# Altium project STM32F103RCT6最小系统.PrjPCB
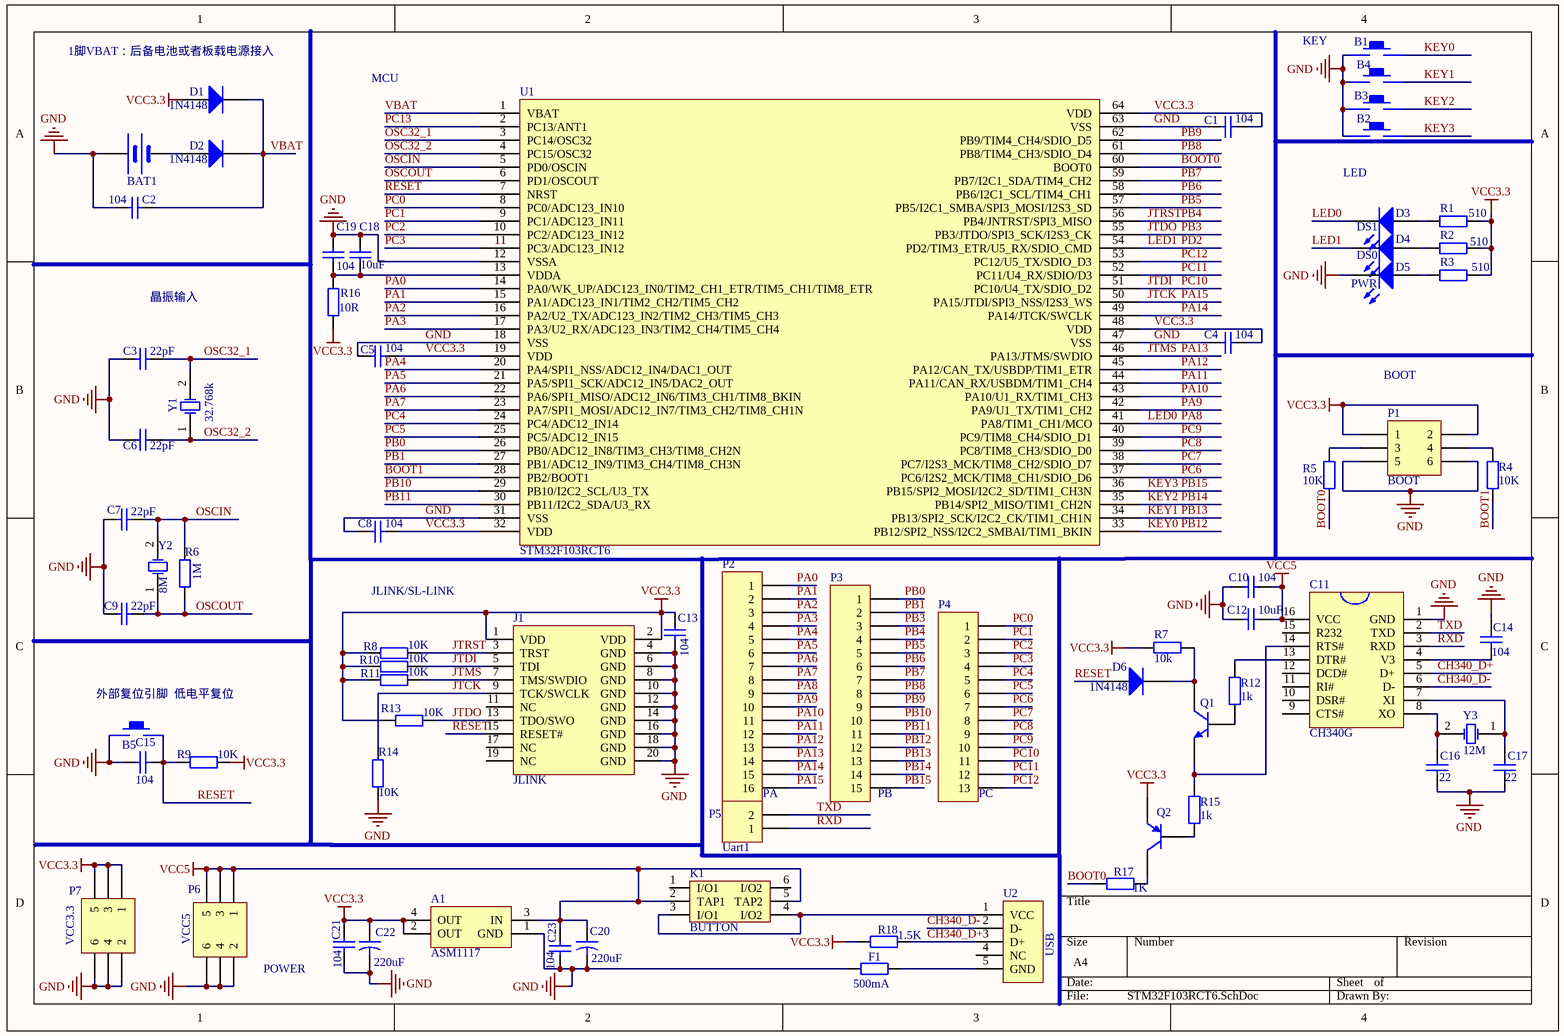
[diagram p0: STM32F103RCT6.SchDoc]
1 sheet, 71 parts. Net scope: global (net labels, ports and power ports of the same name join across sheets).
Board file: STM32F103RCT6最小系统.PcbDoc

## Sheet STM32F103RCT6.SchDoc
size A4

### Parts
A1  ASM1117  [AMS1117]
B1  Button  [KEY_M]  (value not drawn)
B2  Button  [KEY_M]  (value not drawn)
B3  Button  [KEY_M]  (value not drawn)
B4  Button  [KEY_M]  (value not drawn)
B5  Button  [KEY_M]  (value not drawn)
BAT1  BATT  [BATM]  (value not drawn)
C1  104  [0603P]
C2  104  [0603P]
C3  22pF  [0603P]
C4  104  [0603P]
C5  104  [0603P]
C6  22pF  [0603P]
C7  22pF  [0603P]
C8  104  [0603P]
C9  22pF  [0603P]
C10  104  [0603P]
C11  CH340G  [SOP16M]
C12  10uF  [0805]
C13  104  [0603P]
C14  104  [0603P]
C15  104  [0603P]
C16  22  [0603P]
C17  22  [0603P]
C18  10uF  [0805]
C19  104  [0603P]
C20  value 220uF  [CC6.56.5]  (hidden comment: Cap2)
C21  104  [0603P]
C22  value 220uF  [CC6.56.5]  (hidden comment: Cap2)
C23  104  [0603P]
D1  1N4148  [DIODE_SOP]
D2  1N4148  [DIODE_SOP]
D3  DS1  [DIODE_SOP]
D4  DS0  [DIODE_SOP]
D5  PWR  [DIODE_SOP]
D6  1N4148  [DIODE_SOP]
F1  500mA  [0805]
J1  JLINK  [JTAG_20]
K1  BUTTON  [BTN8.5*8.5]
P1  BOOT  [HDR2X3]
P2  PA  [HDR1X16]
P3  PB  [HDR1X15]
P4  PC  [HDR1X13]
P5  Uart1  [HDR1X2]
P6  VCC5  [HDR2X3]
P7  VCC3.3  [HDR2X3]
Q1  2N3904  [SOT-23R]  (value not drawn)
Q2  2N3906  [SOT-23R]  (value not drawn)
R1  value 510  [0603P]  (hidden comment: Res2)
R2  value 510  [0603P]  (hidden comment: Res2)
R3  value 510  [0603P]  (hidden comment: Res2)
R4  value 10K  [0603P]  (hidden comment: Res2)
R5  value 10K  [0603P]  (hidden comment: Res2)
R6  value 1M  [0603P]  (hidden comment: Res2)
R7  value 10k  [0603P]  (hidden comment: Res2)
R8  value 10K  [0603P]  (hidden comment: Res2)
R9  value 10K  [0603P]  (hidden comment: Res2)
R10  value 10K  [0603P]  (hidden comment: Res2)
R11  value 10K  [0603P]  (hidden comment: Res2)
R12  value 1k  [0603P]  (hidden comment: Res2)
R13  value 10K  [0603P]  (hidden comment: Res2)
R14  value 10K  [0603P]  (hidden comment: Res2)
R15  value 1k  [0603P]  (hidden comment: Res2)
R16  value 10R  [0603P]  (hidden comment: Res2)
R17  value 1K  [0603P]  (hidden comment: Res2)
R18  value 1.5K  [0603P]  (hidden comment: Res2)
U1  STM32F103RCT6  [LQFP64]
U2  USB  [USB/SM0.8-6H5]
Y1  32.768k  [XTAL32]
Y2  8M  [XTAL_US]
Y3  12M  [XTAL_US]

### Nets
GND: A1.1(GND) B1.1 B2.1 B3.1 B4.1 B5.1 BAT1.1(VCC) C1.2 C2.1 C3.1 C4.2 C5.2 C6.1 C7.1 C8.2 C9.1 C10.1 C11.1(GND) C12.1 C13.2 C14.1 C15.2 C16.1 C17.1 C18.1 C19.1 C20.2 C21.1 C22.2 C23.1 D5.2(K) F1.1 J1.4(GND) J1.6(GND) J1.8(GND) J1.10(GND) J1.12(GND) J1.14(GND) J1.16(GND) J1.18(GND) J1.20(GND) P1.5 P1.6 P6.2 P6.4 P6.6 P7.2 P7.4 P7.6 R14.1 U1.12(VSSA) U1.18(VSS) U1.31(VSS) U1.47(VSS) U1.63(VSS)
VCC3.3: A1.2(OUT) A1.4(OUT) C1.1 C4.1 C5.1 C8.1 C13.1 C21.2 C22.1 D1.1(A) J1.1(VDD) J1.2(VDD) P1.1 P1.2 P7.1 P7.3 P7.5 Q2.1(E) R1.1 R2.1 R3.1 R7.1 R8.1 R9.2 R10.1 R11.1 R13.1 R16.2 R18.1 U1.19(VDD) U1.32(VDD) U1.48(VDD) U1.64(VDD)
VCC5: A1.3(IN) C10.2 C11.16(VCC) C12.2 C20.1 C23.2 K1.2(TAP1) K1.5(TAP2) P6.1 P6.3 P6.5
BOOT0: R5.1 R17.1 U1.60(BOOT0)
BOOT1: R4.1 U1.28(PB2/BOOT1)
CH340_D+: C11.5(D+) R18.2 U2.3(D+)
CH340_D-: C11.6(D-) U2.2(D-)
JTCK: J1.9(TCK/SWCLK) P2.16 R14.2 U1.50(PA15/JTDI/SPI3_NSS/I2S3_WS)  [also labelled PA15]
JTDI: J1.5(TDI) P4.11 R10.2 U1.51(PC10/U4_TX/SDIO_D2)  [also labelled PC10]
JTDO: J1.13(TDO/SWO) P3.3 R13.2 U1.55(PB3/JTDO/SPI3_SCK/I2S3_CK)  [also labelled PB3]
JTMS: J1.7(TMS/SWDIO) P2.14 R11.2 U1.46(PA13/JTMS/SWDIO)  [also labelled PA13]
JTRST: J1.3(TRST) P3.4 R8.2 U1.56(PB4/JNTRST/SPI3_MISO)  [also labelled PB4]
KEY0: B1.2 P3.12 U1.33(PB12/SPI2_NSS/I2C2_SMBAI/TIM1_BKIN)  [also labelled PB12]
KEY1: B4.2 P3.13 U1.34(PB13/SPI2_SCK/I2C2_CK/TIM1_CH1N)  [also labelled PB13]
KEY2: B3.2 P3.14 U1.35(PB14/SPI2_MISO/TIM1_CH2N)  [also labelled PB14]
KEY3: B2.2 P3.15 U1.36(PB15/SPI2_MOSI/I2C2_SD/TIM1_CH3N)  [also labelled PB15]
LED0: D3.2(K) P2.9 U1.41(PA8/TIM1_CH1/MCO)  [also labelled PA8]
LED1: D4.2(K) U1.54(PD2/TIM3_ETR/U5_RX/SDIO_CMD)  [also labelled PD2]
OSC32_1: C3.2 U1.3(PC14/OSC32) Y1.2(OSC2)
OSC32_2: C6.2 U1.4(PC15/OSC32) Y1.1(OSC1)
OSCIN: C7.2 R6.2 U1.5(PD0/OSCIN) Y2.2(OSC2)
OSCOUT: C9.2 R6.1 U1.6(PD1/OSCOUT) Y2.1(OSC1)
PA0: P2.1 U1.14(PA0/WK_UP/ADC123_IN0/TIM2_CH1_ETR/TIM5_CH1/TIM8_ETR)
PA1: P2.2 U1.15(PA1/ADC123_IN1/TIM2_CH2/TIM5_CH2)
PA2: P2.3 U1.16(PA2/U2_TX/ADC123_IN2/TIM2_CH3/TIM5_CH3)
PA3: P2.4 U1.17(PA3/U2_RX/ADC123_IN3/TIM2_CH4/TIM5_CH4)
PA4: P2.5 U1.20(PA4/SPI1_NSS/ADC12_IN4/DAC1_OUT)
PA5: P2.6 U1.21(PA5/SPI1_SCK/ADC12_IN5/DAC2_OUT)
PA6: P2.7 U1.22(PA6/SPI1_MISO/ADC12_IN6/TIM3_CH1/TIM8_BKIN)
PA7: P2.8 U1.23(PA7/SPI1_MOSI/ADC12_IN7/TIM3_CH2/TIM8_CH1N)
PA9: P2.10 U1.42(PA9/U1_TX/TIM1_CH2)
PA10: P2.11 U1.43(PA10/U1_RX/TIM1_CH3)
PA11: P2.12 U1.44(PA11/CAN_RX/USBDM/TIM1_CH4)
PA12: P2.13 U1.45(PA12/CAN_TX/USBDP/TIM1_ETR)
PA14: P2.15 U1.49(PA14/JTCK/SWCLK)
PB0: P3.1 U1.26(PB0/ADC12_IN8/TIM3_CH3/TIM8_CH2N)
PB1: P3.2 U1.27(PB1/ADC12_IN9/TIM3_CH4/TIM8_CH3N)
PB5: P3.5 U1.57(PB5/I2C1_SMBA/SPI3_MOSI/I2S3_SD)
PB6: P3.6 U1.58(PB6/I2C1_SCL/TIM4_CH1)
PB7: P3.7 U1.59(PB7/I2C1_SDA/TIM4_CH2)
PB8: P3.8 U1.61(PB8/TIM4_CH3/SDIO_D4)
PB9: P3.9 U1.62(PB9/TIM4_CH4/SDIO_D5)
PB10: P3.10 U1.29(PB10/I2C2_SCL/U3_TX)
PB11: P3.11 U1.30(PB11/I2C2_SDA/U3_RX)
PC0: P4.1 U1.8(PC0/ADC123_IN10)
PC1: P4.2 U1.9(PC1/ADC123_IN11)
PC2: P4.3 U1.10(PC2/ADC123_IN12)
PC3: P4.4 U1.11(PC3/ADC123_IN12)
PC4: P4.5 U1.24(PC4/ADC12_IN14)
PC5: P4.6 U1.25(PC5/ADC12_IN15)
PC6: P4.7 U1.37(PC6/I2S2_MCK/TIM8_CH1/SDIO_D6)
PC7: P4.8 U1.38(PC7/I2S3_MCK/TIM8_CH2/SDIO_D7)
PC8: P4.9 U1.39(PC8/TIM8_CH3/SDIO_D0)
PC9: P4.10 U1.40(PC9/TIM8_CH4/SDIO_D1)
PC11: P4.12 U1.52(PC11/U4_RX/SDIO/D3)
PC12: P4.13 U1.53(PC12/U5_TX/SDIO_D3)
PC13: U1.2(PC13/ANT1)
RESET: B5.2 C15.1 D6.1(A) J1.15(RESET#) R9.1 U1.7(NRST)
RXD: C11.3(RXD) P5.1
TXD: C11.2(TXD) P5.2
VBAT: C2.2 D1.2(K) D2.2(K) U1.1(VBAT)
NetBAT1_2: BAT1.2(GND) D2.1(A)
NetC11_4: C11.4(V3) C14.2
NetC11_7: C11.7(XI) C17.2 Y3.1(OSC1)
NetC11_8: C11.8(XO) C16.2 Y3.2(OSC2)
NetC11_13: C11.13(DTR#) R12.2
NetC11_14: C11.14(RTS#) Q1.1(E) R15.1
NetC18_2: C18.2 C19.2 R16.1 U1.13(VDDA)
NetD3_1: D3.1(A) R1.2
NetD4_1: D4.1(A) R2.2
NetD5_1: D5.1(A) R3.2
NetD6_2: D6.2(K) Q1.3(C) R7.2
NetF1_2: F1.2 U2.5(GND)
NetK1_3: K1.3(I/O1) K1.4(I/O2) U2.1(VCC)
NetP1_3: P1.3 R5.2
NetP1_4: P1.4 R4.2
NetQ1_2: Q1.2(B) R12.1
NetQ2_2: Q2.2(B) R15.2
NetQ2_3: Q2.3(C) R17.2

Not connected (* = marked no-connect by the designer): C11 9(CTS#) 10(DSR#) 11(RI#) 12(DCD#) 15(R232); J1 11(NC) 17(NC) 19(NC); K1 1(I/O1) 6(I/O2); U2 4(NC)

### Notes on the sheet
- KEY
- (near D1) 1脚VBAT：后备电池或者板载电源接入
- MCU
- LED
- 晶振输入
- (near P1) BOOT
- JLINK/SL-LINK
- (near B5) 外部复位引脚  低电平复位
- (near P6) POWER

### Library data of the parts
A1 = AMS117
BAT1 = BAT
C1-C10 C12-C19 C21 C23 = Cap: Capacitor; Value: 100pF; Published: 8-Jun-2000; LatestRevisionDate: 17-Jul-2002; LatestRevisionNote: Re-released for DXP Platform.; PackageReference: RAD-0.3; Publisher: Altium Limited; PackageDescription: Radial Cap, Thru-Hole; 2 Leads; 0.3 in Pin Spacing
C20 C22 = Cap2: Capacitor; Published: 23-Sep-2002; PackageReference: CAPR5-4X5; Publisher: Altium Limited; PackageDescription: Capacitor; 2 Leads
D1 D2 D6 = LED: Published: 8-Jun-2000; LatestRevisionDate: 17-Dec-2003; LatestRevisionNote: PCB Footprint replaced.; DatasheetVersion: 16-Apr-2002; PackageVersion: 16-Apr-2002; PackageReference: 3.5X2.8X1.9; Publisher: Altium Limited; PackageDescription: SM LED; 2 C-Bend Leads; Body 3.5 x 2.8 x 1.9 mm, inc leads (LxWxH typ)
D3-D5 = LED3: Typical BLUE SiC LED; Published: 8-Jun-2000; LatestRevisionDate: 17-Dec-2003; LatestRevisionNote: PCB Footprint replaced.; DatasheetVersion: 16-Apr-2002; PackageVersion: 16-Apr-2002; PackageReference: 3.5X2.8X1.9; Publisher: Altium Limited; PackageDescription: SM LED; 2 C-Bend Leads; Body 3.5 x 2.8 x 1.9 mm, inc leads (LxWxH typ)
F1 = Res2: Resistor; Value: 1.5K; Published: 8-Jun-2000; LatestRevisionDate: 17-Jul-2002; LatestRevisionNote: Re-released for DXP Platform.; PackageReference: AXIAL-0.4; Publisher: Altium Limited; PackageDescription: Axial Device, Thru-Hole; 2 Leads; 0.4 in Pin Spacing
J1 = JLINK2X10: LatestRevisionDate: 17-Jul-2002; LatestRevisionNote: Re-released for DXP Platform.; Publisher: Altium Limited
P1 P6 P7 = Header 3X2: Header, 3-Pin, Dual row; LatestRevisionDate: 17-Jul-2002; LatestRevisionNote: Re-released for DXP Platform.; Publisher: Altium Limited
P2 = Header 16: Header, 16-Pin; LatestRevisionDate: 17-Jul-2002; LatestRevisionNote: Re-released for DXP Platform.; Publisher: Altium Limited
P3 = Header 15: Header, 15-Pin; LatestRevisionDate: 17-Jul-2002; LatestRevisionNote: Re-released for DXP Platform.; Publisher: Altium Limited
P4 = Header 13: Header, 13-Pin; LatestRevisionDate: 17-Jul-2002; LatestRevisionNote: Re-released for DXP Platform.; Publisher: Altium Limited
P5 = Header 2: Header, 2-Pin; LatestRevisionDate: 17-Jul-2002; LatestRevisionNote: Re-released for DXP Platform.; Publisher: Altium Limited
Q1 = 2N3904: NPN General Purpose Amplifier; Published: 8-Jun-2000; LatestRevisionDate: 15-Jan-2003; LatestRevisionNote: PCB Footprint 'BCY-W3/D4.7' replaced; DatasheetVersion: 1997; PackageVersion: Sep-1998; PackageReference: TO-92A; Publisher: Altium Limited; PackageDescription: TO, Flat Index; 3 In-Line, Axial Leads; Body Dia. 4.5mm; Leads 0.51 x 0.48 mm (max); ComponentLink1Description: Manufacturer Link; ComponentLink1URL: http://www.fairchildsemi.com/; ComponentLink2Description: Datasheet; ComponentLink2URL: http://www.fairchildsemi.com/ds/2N%2F2N3904.pdf
Q2 = 2N3906: PNP General Purpose Amplifier; Published: 8-Jun-2000; LatestRevisionDate: 15-Jan-2003; LatestRevisionNote: PCB Footprint 'BCY-W3/D4.7' replaced; DatasheetVersion: 1997; PackageVersion: Sep-1998; PackageReference: TO-92A; Publisher: Altium Limited; PackageDescription: TO, Flat Index; 3 In-Line, Axial Leads; Body Dia. 4.5mm; Leads 0.51 x 0.48 mm (max); ComponentLink1Description: Manufacturer Link; ComponentLink1URL: http://www.fairchildsemi.com/; ComponentLink2Description: Datasheet; ComponentLink2URL: http://www.fairchildsemi.com/ds/2N%2F2N3906.pdf
R1-R18 = Res2: Resistor; Published: 8-Jun-2000; LatestRevisionDate: 17-Jul-2002; LatestRevisionNote: Re-released for DXP Platform.; PackageReference: AXIAL-0.4; Publisher: Altium Limited; PackageDescription: Axial Device, Thru-Hole; 2 Leads; 0.4 in Pin Spacing
U1 = STM32F103RCT6_64Pin
Y1-Y3 = XTAL: Crystal Oscillator; Published: 8-Jun-2000; LatestRevisionDate: 17-Jul-2002; LatestRevisionNote: Re-released for DXP Platform.; PackageReference: R38; Publisher: Altium Limited; PackageDescription: Crystal, Thru-Hole; 2 Leads; Body 3.1 x 8.2 mm (Dia.xH)